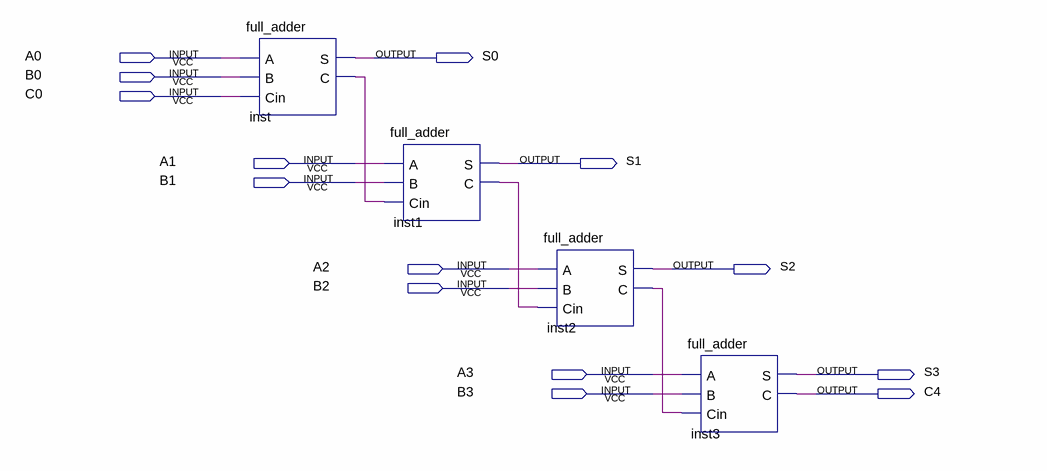
[diagram p0: schematic sheet]
// Quartus schematic ripple_carry_adder_4bit.bdf as structural Verilog: 4 symbols, 14 pins
module ripple_carry_adder_4bit (
  input  A0,
  input  B0,
  input  C0,
  input  A1,
  input  B1,
  input  A2,
  input  B2,
  input  A3,
  input  B3,
  output S0,
  output S1,
  output S2,
  output S3,
  output C4
);

  wire inst1_c, inst2_c, inst_c;

  full_adder inst (.A(A0), .B(B0), .Cin(C0), .S(S0), .C(inst_c));
  full_adder inst1 (.A(A1), .B(B1), .Cin(inst_c), .S(S1), .C(inst1_c));
  full_adder inst2 (.A(A2), .B(B2), .Cin(inst1_c), .S(S2), .C(inst2_c));
  full_adder inst3 (.A(A3), .B(B3), .Cin(inst2_c), .S(S3), .C(C4));
endmodule
